# EAGLE schematic max10adc (EAGLE 8.6.1)
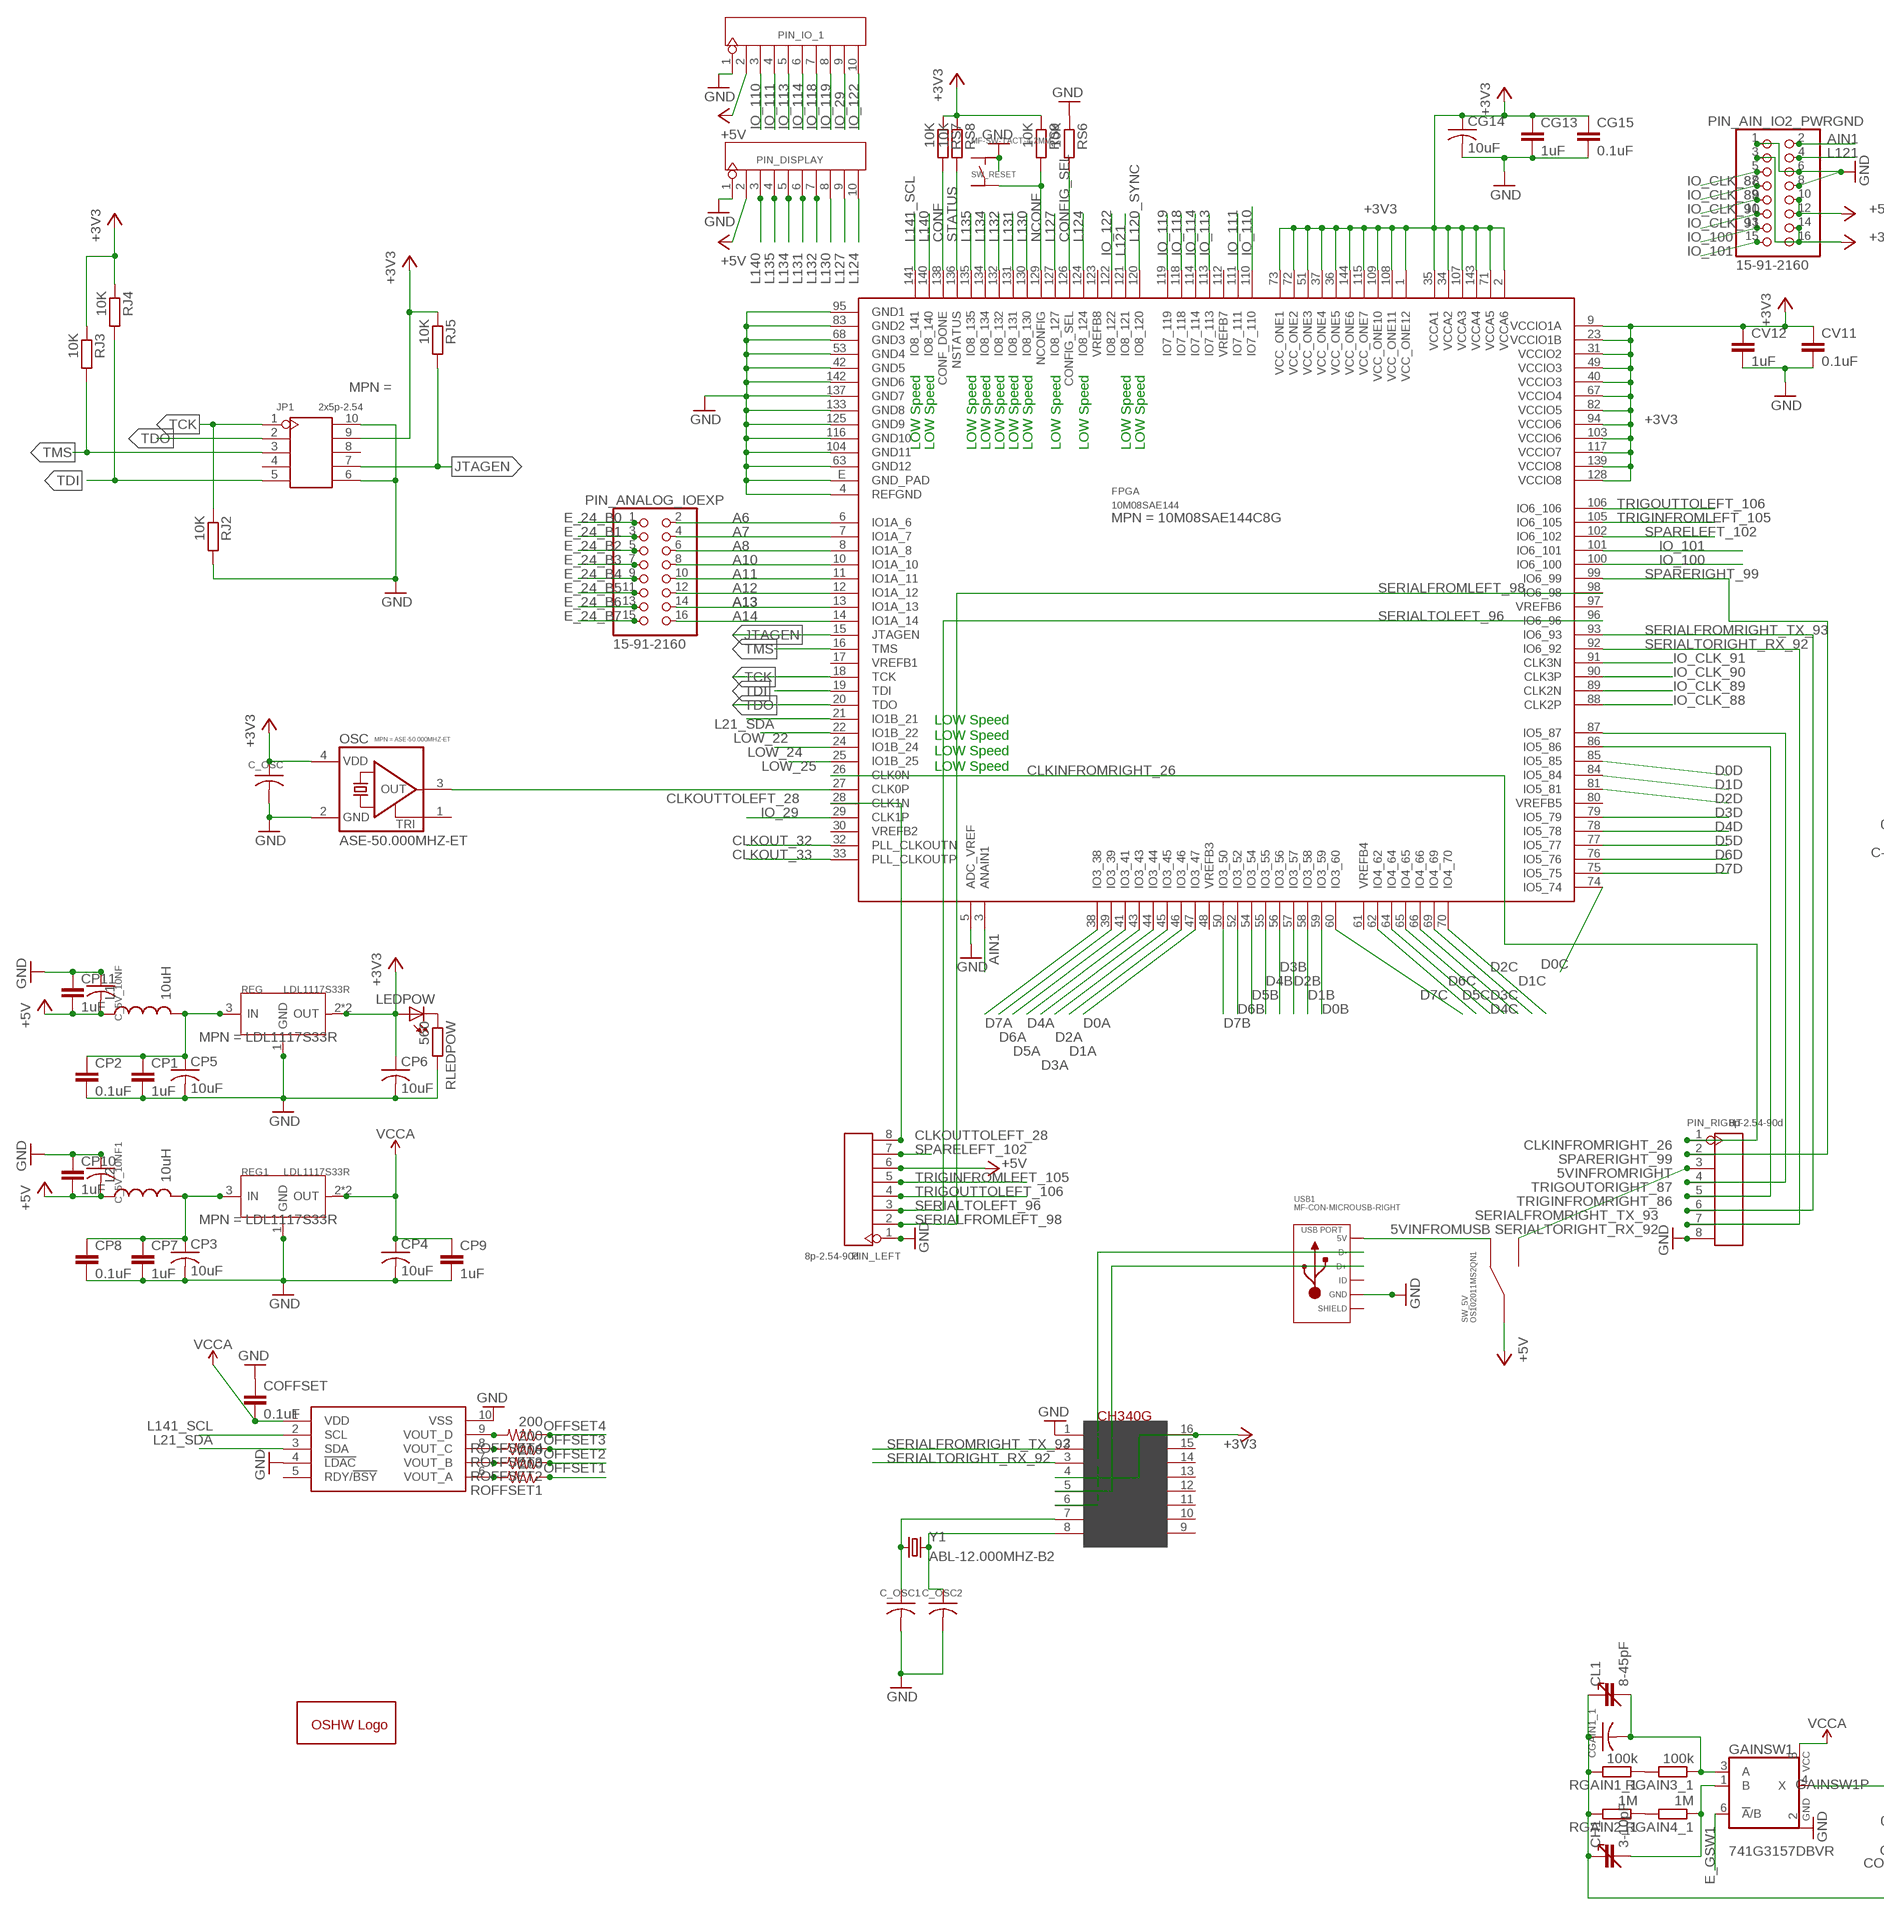
[diagram p0: schematic, sheet 1, part 1 of 2]
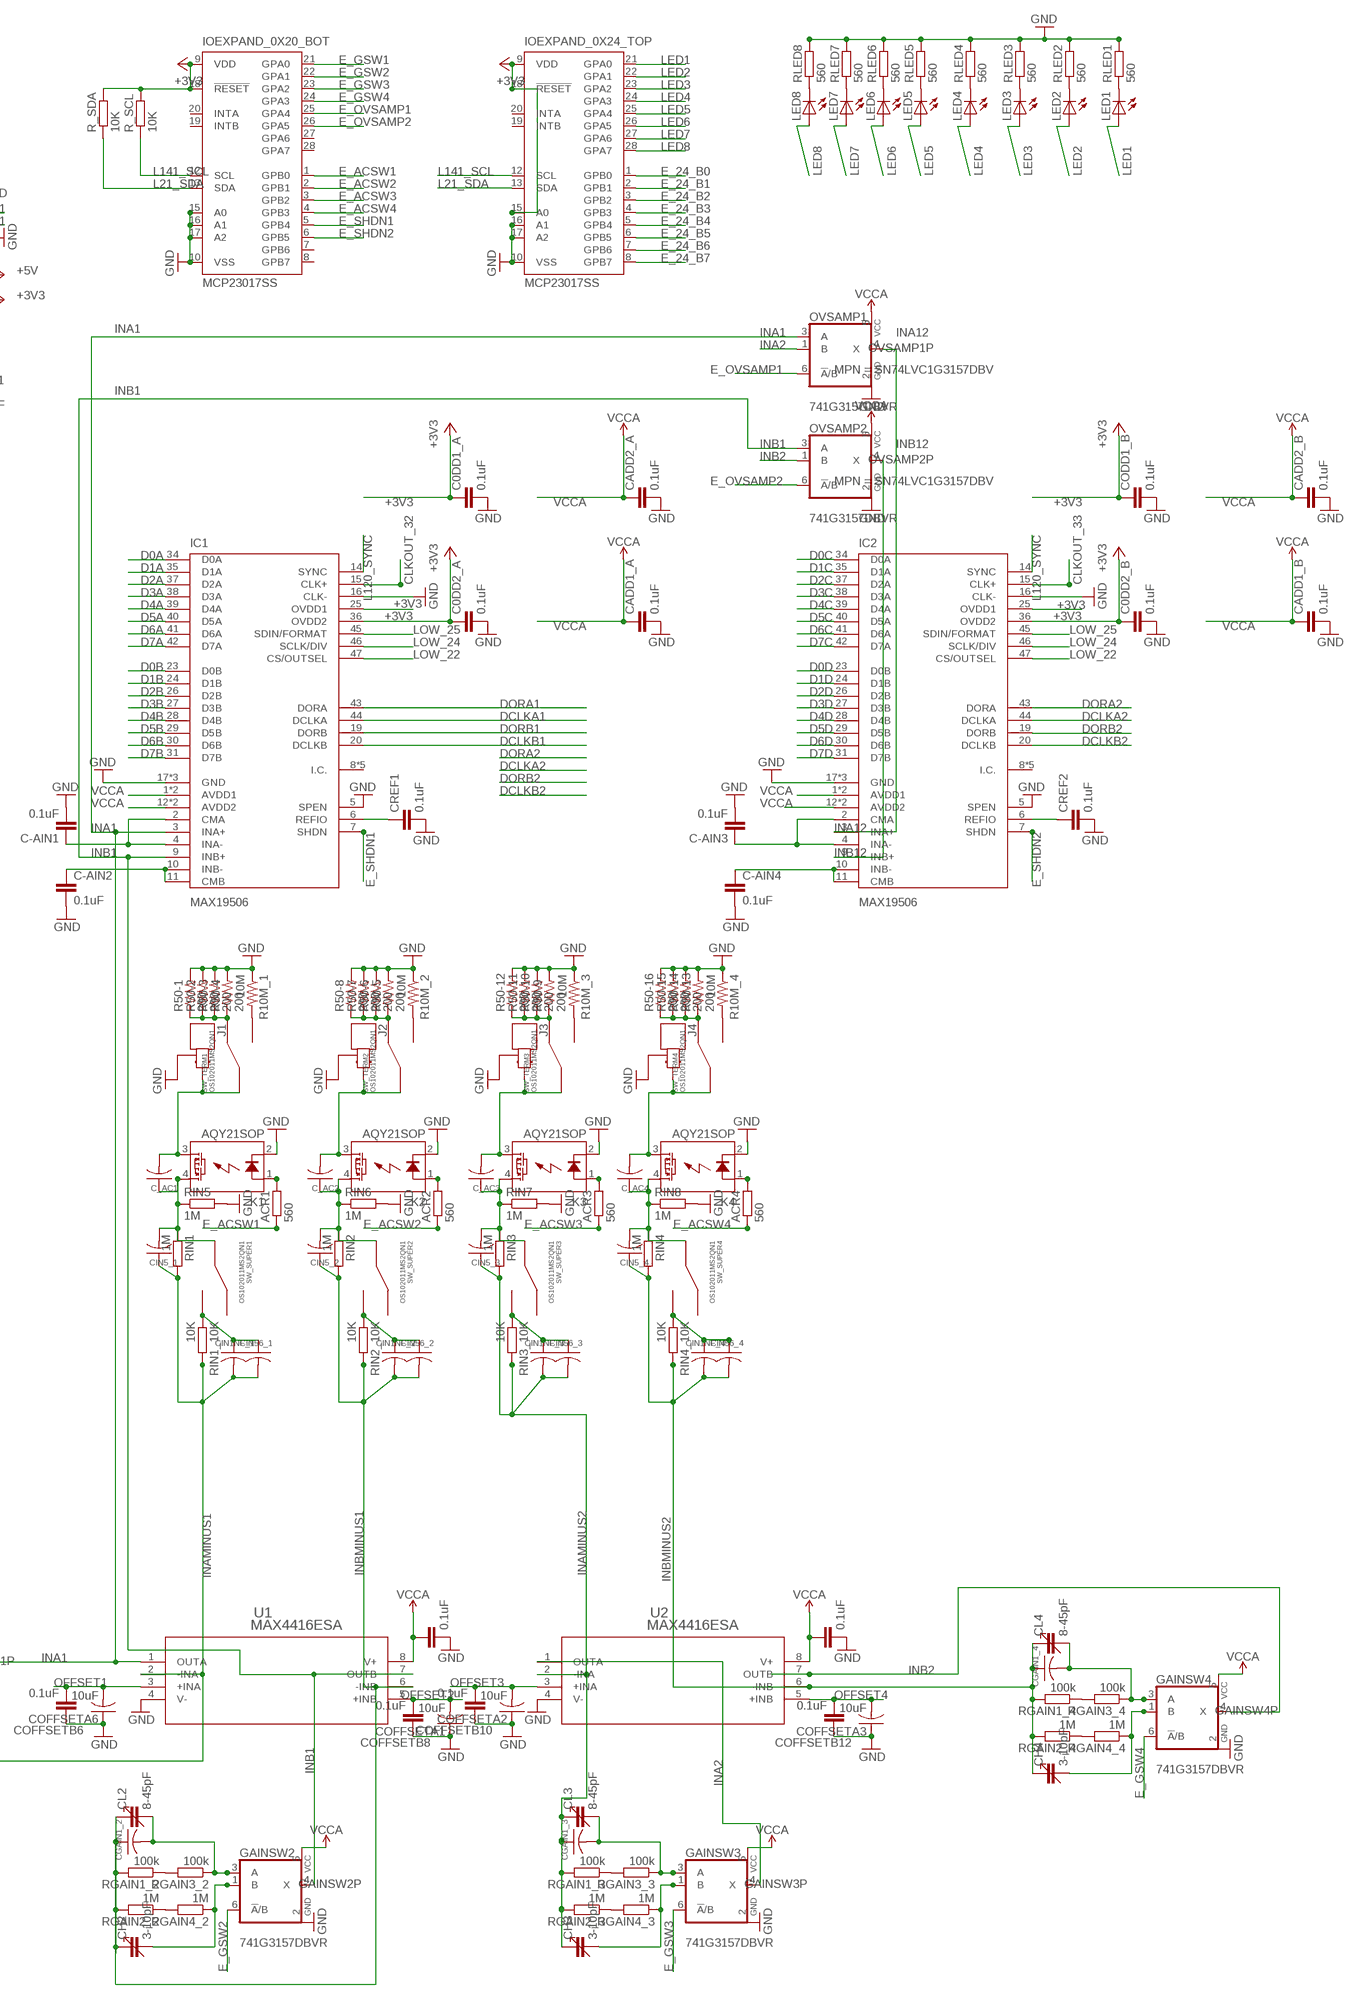
[diagram p1: schematic, sheet 1, part 2 of 2]

## Parts
ACR1  560  R-EU_R0805  [R0805]
ACR2  560  R-EU_R0805  [R0805]
ACR3  560  R-EU_R0805  [R0805]
ACR4  560  R-EU_R0805  [R0805]
C0DD1_A  0.1uF  C-EUC0805K  [C0805K]
C0DD2_A  0.1uF  C-EUC0805K  [C0805K]
C0DD2_B  0.1uF  C-EUC0805K  [C0805K]
C5VOPAMP1  0.1uF  C-EUC0805K  [C0805K]
C5VOPAMP2  0.1uF  C-EUC0805K  [C0805K]
C-AIN1  0.1uF  C-EUC0805K  [C0805K]
C-AIN2  0.1uF  C-EUC0805K  [C0805K]
C-AIN3  0.1uF  C-EUC0805K  [C0805K]
C-AIN4  0.1uF  C-EUC0805K  [C0805K]
C_5V_10NF  0.01uF  C-USC0603  [C0603]
C_5V_10NF1  0.01uF  C-USC0603  [C0603]
C_AC1  0.01uF  C-USC0603  [C0603]
C_AC2  0.01uF  C-USC0603  [C0603]
C_AC3  0.01uF  C-USC0603  [C0603]
C_AC4  0.01uF  C-USC0603  [C0603]
C_OSC  0.01uF  C-USC0603  [C0603]
C_OSC1  22pF  C-USC0603  [C0603]
C_OSC2  22pF  C-USC0603  [C0603]
CADD1_A  0.1uF  C-EUC0805K  [C0805K]
CADD1_B  0.1uF  C-EUC0805K  [C0805K]
CADD2_A  0.1uF  C-EUC0805K  [C0805K]
CADD2_B  0.1uF  C-EUC0805K  [C0805K]
CG13  1uF  C-EUC0805K  [C0805K]
CG14  10uF  C-USC1206  [C1206]
CG15  0.1uF  C-EUC0805K  [C0805K]
CGAIN1_1  33pF  C-USC0603  [C0603]
CGAIN1_2  33pF  C-USC0603  [C0603]
CGAIN1_3  33pF  C-USC0603  [C0603]
CGAIN1_4  33pF  C-USC0603  [C0603]
CH1  3-10pF  CAP_ADJSMD  [CTZ3]
CH2  3-10pF  CAP_ADJSMD  [CTZ3]
CH3  3-10pF  CAP_ADJSMD  [CTZ3]
CH4  3-10pF  CAP_ADJSMD  [CTZ3]
CIN1NF_1  1nF  C-USC0603  [C0603]
CIN1NF_2  1nF  C-USC0603  [C0603]
CIN1NF_3  1nF  C-USC0603  [C0603]
CIN1NF_4  1nF  C-USC0603  [C0603]
CIN5_1  10pF  C-USC0603  [C0603]
CIN5_2  10pF  C-USC0603  [C0603]
CIN5_3  10pF  C-USC0603  [C0603]
CIN5_4  10pF  C-USC0603  [C0603]
CIN56_1  56pF  C-USC0603  [C0603]
CIN56_2  56pF  C-USC0603  [C0603]
CIN56_3  56pF  C-USC0603  [C0603]
CIN56_4  56pF  C-USC0603  [C0603]
CL1  8-45pF  CAP_ADJSMD  [CTZ3]
CL2  8-45pF  CAP_ADJSMD  [CTZ3]
CL3  8-45pF  CAP_ADJSMD  [CTZ3]
CL4  8-45pF  CAP_ADJSMD  [CTZ3]
CODD1_B  0.1uF  C-EUC0805K  [C0805K]
COFFSET  0.1uF  C-EUC0805K  [C0805K]
COFFSETA1  10uF  C-USC1206  [C1206]
COFFSETA2  10uF  C-USC1206  [C1206]
COFFSETA3  10uF  C-USC1206  [C1206]
COFFSETA6  10uF  C-USC1206  [C1206]
COFFSETB6  0.1uF  C-EUC0805K  [C0805K]
COFFSETB8  0.1uF  C-EUC0805K  [C0805K]
COFFSETB10  0.1uF  C-EUC0805K  [C0805K]
COFFSETB12  0.1uF  C-EUC0805K  [C0805K]
CP1  1uF  C-EUC0805K  [C0805K]
CP2  0.1uF  C-EUC0805K  [C0805K]
CP3  10uF  C-USC1206  [C1206]
CP4  10uF  C-USC1206  [C1206]
CP5  10uF  C-USC1206  [C1206]
CP6  10uF  C-USC1206  [C1206]
CP7  1uF  C-EUC0805K  [C0805K]
CP8  0.1uF  C-EUC0805K  [C0805K]
CP9  1uF  C-EUC0805K  [C0805K]
CP10  1uF  C-EUC0805K  [C0805K]
CP11  1uF  C-EUC0805K  [C0805K]
CREF1  0.1uF  C-EUC0805K  [C0805K]
CREF2  0.1uF  C-EUC0805K  [C0805K]
CV11  0.1uF  C-EUC0805K  [C0805K]
CV12  1uF  C-EUC0805K  [C0805K]
DAC1  MCP4728  [MSOP10]
FPGA  10M08SAE144  [EQFP144]
GAINSW1  741G3157DBVR  [DBV_R-PDSO-G6]
GAINSW2  741G3157DBVR  [DBV_R-PDSO-G6]
GAINSW3  741G3157DBVR  [DBV_R-PDSO-G6]
GAINSW4  741G3157DBVR  [DBV_R-PDSO-G6]
GOLD_ORB_SM1  OSHWLOGOLOGO8MM  [OSHW_8MM]
IC1  MAX19506  [TQFP-48]
IC2  MAX19506  [TQFP-48]
IOEXPAND_0X20_BOT  MCP23017SS  [SSOP28]
IOEXPAND_0X24_TOP  MCP23017SS  [SSOP28]
J1  MOLEX_BNC_73100-0105  [MOLEX-BNC-73100-0105]
J2  MOLEX_BNC_73100-0105  [MOLEX-BNC-73100-0105]
J3  MOLEX_BNC_73100-0105  [MOLEX-BNC-73100-0105]
J4  MOLEX_BNC_73100-0105  [MOLEX-BNC-73100-0105]
JP1  2x5p-2.54  DIP-BLACK-MALE-HEADER(2X5P-2.54)  [H2X5-2.54]
K1  AQY21SOP  [SOP04]
K2  AQY21SOP  [SOP04]
K3  AQY21SOP  [SOP04]
K4  AQY21SOP  [SOP04]
L1  10uH  INDUCTOR1210  [1210]
L2  10uH  INDUCTOR1210  [1210]
LED1  MF-LED-0805-RED  LEDSML0805  [SML0805]
LED2  MF-LED-0805-RED  LEDSML0805  [SML0805]
LED3  MF-LED-0805-RED  LEDSML0805  [SML0805]
LED4  MF-LED-0805-RED  LEDSML0805  [SML0805]
LED5  MF-LED-0805-RED  LEDSML0805  [SML0805]
LED6  MF-LED-0805-RED  LEDSML0805  [SML0805]
LED7  MF-LED-0805-RED  LEDSML0805  [SML0805]
LED8  MF-LED-0805-RED  LEDSML0805  [SML0805]
LEDPOW  MF-LED-0805-RED  LEDSML0805  [SML0805]
OSC  ASE-50.000MHZ-ET  ASE  [ASE]
OVSAMP1  741G3157DBVR  [DBV_R-PDSO-G6]
OVSAMP2  741G3157DBVR  [DBV_R-PDSO-G6]
PIN_AIN_IO2_PWRGND  15-91-2160  PINHD-2X8SMT  [2X08_SMT]
PIN_ANALOG_IOEXP  15-91-2160  PINHD-2X8SMT  [2X08_SMT]
PIN_DISPLAY  YELLOW-10P-2.54  DIP-YELLOW-FEMALE-HEADER-VERT(10P-2.54)  [H10-2.54]
PIN_IO_1  YELLOW-10P-2.54  DIP-YELLOW-FEMALE-HEADER-VERT(10P-2.54)  [H10-2.54]
PIN_LEFT  8p-2.54-90d  DIP-BLACK-SHORT-MALE-HEADER-R/A(8P-2.54-90D)  [H8-2.54-90D-MALE]
PIN_RIGHT  8p-2.54-90d  DIP-BLACK-FEMALE-HEADER-R/A(8P-2.54-90D)  [H8-2.54-90D-FEMALE]
R10M_1  10M  R-US_R0805  [R0805]
R10M_2  10M  R-US_R0805  [R0805]
R10M_3  10M  R-US_R0805  [R0805]
R10M_4  10M  R-US_R0805  [R0805]
R50-1  200  R-US_R0805  [R0805]
R50-2  200  R-US_R0805  [R0805]
R50-3  200  R-US_R0805  [R0805]
R50-4  200  R-US_R0805  [R0805]
R50-5  200  R-US_R0805  [R0805]
R50-6  200  R-US_R0805  [R0805]
R50-7  200  R-US_R0805  [R0805]
R50-8  200  R-US_R0805  [R0805]
R50-9  200  R-US_R0805  [R0805]
R50-10  200  R-US_R0805  [R0805]
R50-11  200  R-US_R0805  [R0805]
R50-12  200  R-US_R0805  [R0805]
R50-13  200  R-US_R0805  [R0805]
R50-14  200  R-US_R0805  [R0805]
R50-15  200  R-US_R0805  [R0805]
R50-16  200  R-US_R0805  [R0805]
R_SCL  10K  R-EU_R0805  [R0805]
R_SDA  10K  R-EU_R0805  [R0805]
REG  LDL1117S33R  PMIC-CJT1117-3.3(SOT223)  [SOT-223]
REG1  LDL1117S33R  PMIC-CJT1117-3.3(SOT223)  [SOT-223]
RGAIN1_1  100k  R-EU_R0805  [R0805]
RGAIN1_2  100k  R-EU_R0805  [R0805]
RGAIN1_3  100k  R-EU_R0805  [R0805]
RGAIN1_4  100k  R-EU_R0805  [R0805]
RGAIN2_1  1M  R-EU_R0805  [R0805]
RGAIN2_2  1M  R-EU_R0805  [R0805]
RGAIN2_3  1M  R-EU_R0805  [R0805]
RGAIN2_4  1M  R-EU_R0805  [R0805]
RGAIN3_1  100k  R-EU_R0805  [R0805]
RGAIN3_2  100k  R-EU_R0805  [R0805]
RGAIN3_3  100k  R-EU_R0805  [R0805]
RGAIN3_4  100k  R-EU_R0805  [R0805]
RGAIN4_1  1M  R-EU_R0805  [R0805]
RGAIN4_2  1M  R-EU_R0805  [R0805]
RGAIN4_3  1M  R-EU_R0805  [R0805]
RGAIN4_4  1M  R-EU_R0805  [R0805]
RIN1  1M  R-EU_R0805  [R0805]
RIN1_10K  10K  R-EU_R0805  [R0805]
RIN2  1M  R-EU_R0805  [R0805]
RIN2_10K  10K  R-EU_R0805  [R0805]
RIN3  1M  R-EU_R0805  [R0805]
RIN3_10K  10K  R-EU_R0805  [R0805]
RIN4  1M  R-EU_R0805  [R0805]
RIN4_10K  10K  R-EU_R0805  [R0805]
RIN5  1M  R-EU_R0805  [R0805]
RIN6  1M  R-EU_R0805  [R0805]
RIN7  1M  R-EU_R0805  [R0805]
RIN8  1M  R-EU_R0805  [R0805]
RJ2  10K  R-EU_R0805  [R0805]
RJ3  10K  R-EU_R0805  [R0805]
RJ4  10K  R-EU_R0805  [R0805]
RJ5  10K  R-EU_R0805  [R0805]
RLED1  560  R-EU_R0805  [R0805]
RLED2  560  R-EU_R0805  [R0805]
RLED3  560  R-EU_R0805  [R0805]
RLED4  560  R-EU_R0805  [R0805]
RLED5  560  R-EU_R0805  [R0805]
RLED6  560  R-EU_R0805  [R0805]
RLED7  560  R-EU_R0805  [R0805]
RLED8  560  R-EU_R0805  [R0805]
RLEDPOW  560  R-EU_R0805  [R0805]
ROFFSET1  200  R-US_R0805  [R0805]
ROFFSET2  200  R-US_R0805  [R0805]
ROFFSET3  200  R-US_R0805  [R0805]
ROFFSET4  200  R-US_R0805  [R0805]
RS6  10K  R-EU_R0805  [R0805]
RS7  10K  R-EU_R0805  [R0805]
RS8  10K  R-EU_R0805  [R0805]
RS9  10K  R-EU_R0805  [R0805]
SW_5V  OS102011MS2QN1  SPDT_0S102011MS2QS1  [0S102011MS2QS1]
SW_RESET  MF-SW-TACT-4.2MM  TACT_4.2MM  [TACT4.2MM]
SW_SUPER1  OS102011MS2QN1  SPDT_0S102011MS2QS1  [0S102011MS2QS1]
SW_SUPER2  OS102011MS2QN1  SPDT_0S102011MS2QS1  [0S102011MS2QS1]
SW_SUPER3  OS102011MS2QN1  SPDT_0S102011MS2QS1  [0S102011MS2QS1]
SW_SUPER4  OS102011MS2QN1  SPDT_0S102011MS2QS1  [0S102011MS2QS1]
SW_TERM1  OS102011MS2QN1  SPDT_0S102011MS2QS1  [0S102011MS2QS1]
SW_TERM2  OS102011MS2QN1  SPDT_0S102011MS2QS1  [0S102011MS2QS1]
SW_TERM3  OS102011MS2QN1  SPDT_0S102011MS2QS1  [0S102011MS2QS1]
SW_TERM4  OS102011MS2QN1  SPDT_0S102011MS2QS1  [0S102011MS2QS1]
U1  MAX4416ESA  LMH6724MAX  [M08A]
U2  MAX4416ESA  LMH6724MAX  [M08A]
U340G  CH340G  [SOIC16]
USB1  MF-CON-MICROUSB-RIGHT  USB_5PIN_10118193-0001LF  [10118193-0001LF]
Y1  ABL-12.000MHZ-B2  CRYSTALHC49US  [HC49US]

## Nets
5VINFROMRIGHT [five]: PIN_RIGHT.3 SW_5V.3
5VINFROMUSB [five]: SW_5V.1 USB1.1(5V)
+3V3 [three]: C0DD1_A.1 C0DD2_A.1 C0DD2_B.1 C_OSC.1 CG13.1 CG14.1 CG15.1 CODD1_B.1 CP6.1 CV11.1 CV12.1 FPGA.1(VCC_ONE12) FPGA.2(VCCA6) FPGA.9(VCCIO1A) FPGA.23(VCCIO1B) FPGA.31(VCCIO2) FPGA.34(VCCA2) FPGA.35(VCCA1) FPGA.36(VCC_ONE5) FPGA.37(VCC_ONE4) FPGA.40(VCCIO3) FPGA.49(VCCIO3) FPGA.51(VCC_ONE3) FPGA.67(VCCIO4) FPGA.71(VCCA5) FPGA.72(VCC_ONE2) FPGA.73(VCC_ONE1) FPGA.82(VCCIO5) FPGA.94(VCCIO6) FPGA.103(VCCIO6) FPGA.107(VCCA3) FPGA.108(VCC_ONE11) FPGA.109(VCC_ONE10) FPGA.115(VCC_ONE7) FPGA.117(VCCIO7) FPGA.128(VCCIO8) FPGA.139(VCCIO8) FPGA.143(VCCA4) FPGA.144(VCC_ONE6) IC1.25(OVDD1) IC1.36(OVDD2) IC2.25(OVDD1) IC2.36(OVDD2) IOEXPAND_0X20_BOT.9(VDD) IOEXPAND_0X20_BOT.18(!RESET) IOEXPAND_0X24_TOP.9(VDD) IOEXPAND_0X24_TOP.15(A0) IOEXPAND_0X24_TOP.18(!RESET) JP1.9 LEDPOW.A OSC.4(VDD) PIN_AIN_IO2_PWRGND.3 PIN_AIN_IO2_PWRGND.14 PIN_AIN_IO2_PWRGND.16 R_SCL.2 R_SDA.2 REG.2(OUT) REG.TER(OUT) RJ3.1 RJ4.1 RJ5.1 RS7.1 RS8.1 RS9.1 U340G.4(V3) U340G.16(VCC)
+5V [five]: C_5V_10NF1.2 C_5V_10NF.2 CP10.2 CP11.2 L1.1 L2.1 PIN_AIN_IO2_PWRGND.10 PIN_AIN_IO2_PWRGND.12 PIN_DISPLAY.2 PIN_IO_1.2 PIN_LEFT.6 SW_5V.2(C)
A6: FPGA.6(IO1A_6) PIN_ANALOG_IOEXP.2
A7: FPGA.7(IO1A_7) PIN_ANALOG_IOEXP.4
A8: FPGA.8(IO1A_8) PIN_ANALOG_IOEXP.6
A10: FPGA.10(IO1A_10) PIN_ANALOG_IOEXP.8
A11: FPGA.11(IO1A_11) PIN_ANALOG_IOEXP.10
A12: FPGA.12(IO1A_12) PIN_ANALOG_IOEXP.12
A13: FPGA.13(IO1A_13) PIN_ANALOG_IOEXP.14
A14: FPGA.14(IO1A_14) PIN_ANALOG_IOEXP.16
AIN1: FPGA.3(ANAIN1) PIN_AIN_IO2_PWRGND.2
CGAIN1: CGAIN1_1.2 CL1.- GAINSW1.3(A) RGAIN3_1.1
CGAIN2: CH1.- GAINSW1.1(B) RGAIN4_1.1
CGAIN3: CGAIN1_2.2 CL2.- GAINSW2.3(A) RGAIN3_2.1
CGAIN4: CH2.- GAINSW2.1(B) RGAIN4_2.1
CGAIN5: CGAIN1_3.2 CL3.- GAINSW3.3(A) RGAIN3_3.1
CGAIN6: CH3.- GAINSW3.1(B) RGAIN4_3.1
CGAIN7: CGAIN1_4.2 CL4.- GAINSW4.3(A) RGAIN3_4.1
CGAIN8: CH4.- GAINSW4.1(B) RGAIN4_4.1
CLKINFROMRIGHT_26: FPGA.26(CLK0N) PIN_RIGHT.1
CLKOUT_32: FPGA.32(PLL_CLKOUTN) IC1.15(CLK+)
CLKOUT_33: FPGA.33(PLL_CLKOUTP) IC2.15(CLK+)
CLKOUTTOLEFT_28: FPGA.28(CLK1N) PIN_LEFT.8
CONF: FPGA.138(CONF_DONE) RS7.2
CONFIG_SEL: FPGA.126(CONFIG_SEL) RS6.2
D0A: FPGA.47(IO3_47) IC1.34(D0A)
D0B: FPGA.59(IO3_59) IC1.23(D0B)
D0C: FPGA.74(IO5_74) IC2.34(D0A)
D0D: FPGA.85(IO5_85) IC2.23(D0B)
D1A: FPGA.46(IO3_46) IC1.35(D1A)
D1B: FPGA.58(IO3_58) IC1.24(D1B)
D1C: FPGA.70(IO4_70) IC2.35(D1A)
D1D: FPGA.84(IO5_84) IC2.24(D1B)
D2A: FPGA.45(IO3_45) IC1.37(D2A)
D2B: FPGA.57(IO3_57) IC1.26(D2B)
D2C: FPGA.69(IO4_69) IC2.37(D2A)
D2D: FPGA.81(IO5_81) IC2.26(D2B)
D3A: FPGA.44(IO3_44) IC1.38(D3A)
D3B: FPGA.56(IO3_56) IC1.27(D3B)
D3C: FPGA.66(IO4_66) IC2.38(D3A)
D3D: FPGA.79(IO5_79) IC2.27(D3B)
D4A: FPGA.43(IO3_43) IC1.39(D4A)
D4B: FPGA.55(IO3_55) IC1.28(D4B)
D4C: FPGA.65(IO4_65) IC2.39(D4A)
D4D: FPGA.78(IO5_78) IC2.28(D4B)
D5A: FPGA.41(IO3_41) IC1.40(D5A)
D5B: FPGA.54(IO3_54) IC1.29(D5B)
D5C: FPGA.64(IO4_64) IC2.40(D5A)
D5D: FPGA.77(IO5_77) IC2.29(D5B)
D6A: FPGA.39(IO3_39) IC1.41(D6A)
D6B: FPGA.52(IO3_52) IC1.30(D6B)
D6C: FPGA.62(IO4_62) IC2.41(D6A)
D6D: FPGA.76(IO5_76) IC2.30(D6B)
D7A: FPGA.38(IO3_38) IC1.42(D7A)
D7B: FPGA.50(IO3_50) IC1.31(D7B)
D7C: FPGA.60(IO3_60) IC2.42(D7A)
D7D: FPGA.75(IO5_75) IC2.31(D7B)
DCLKA1: IC1.44(DCLKA)
DCLKA2: IC2.44(DCLKA)
DCLKB1: IC1.20(DCLKB)
DCLKB2: IC2.20(DCLKB)
DMINUS: U340G.6(D-) USB1.2(D-)
DORA1: IC1.43(DORA)
DORA2: IC2.43(DORA)
DORB1: IC1.19(DORB)
DORB2: IC2.19(DORB)
DPLUS: U340G.5(D+) USB1.3(D+)
E_24_B0: IOEXPAND_0X24_TOP.1(GPB0) PIN_ANALOG_IOEXP.1
E_24_B1: IOEXPAND_0X24_TOP.2(GPB1) PIN_ANALOG_IOEXP.3
E_24_B2: IOEXPAND_0X24_TOP.3(GPB2) PIN_ANALOG_IOEXP.5
E_24_B3: IOEXPAND_0X24_TOP.4(GPB3) PIN_ANALOG_IOEXP.7
E_24_B4: IOEXPAND_0X24_TOP.5(GPB4) PIN_ANALOG_IOEXP.9
E_24_B5: IOEXPAND_0X24_TOP.6(GPB5) PIN_ANALOG_IOEXP.11
E_24_B6: IOEXPAND_0X24_TOP.7(GPB6) PIN_ANALOG_IOEXP.13
E_24_B7: IOEXPAND_0X24_TOP.8(GPB7) PIN_ANALOG_IOEXP.15
E_ACSW1: ACR1.1 IOEXPAND_0X20_BOT.1(GPB0)
E_ACSW2: ACR2.1 IOEXPAND_0X20_BOT.2(GPB1)
E_ACSW3: ACR3.1 IOEXPAND_0X20_BOT.3(GPB2)
E_ACSW4: ACR4.1 IOEXPAND_0X20_BOT.4(GPB3)
E_GSW1: GAINSW1.6(!A!/B) IOEXPAND_0X20_BOT.21(GPA0)
E_GSW2: GAINSW2.6(!A!/B) IOEXPAND_0X20_BOT.22(GPA1)
E_GSW3: GAINSW3.6(!A!/B) IOEXPAND_0X20_BOT.23(GPA2)
E_GSW4: GAINSW4.6(!A!/B) IOEXPAND_0X20_BOT.24(GPA3)
E_OVSAMP1: IOEXPAND_0X20_BOT.25(GPA4) OVSAMP1.6(!A!/B)
E_OVSAMP2: IOEXPAND_0X20_BOT.26(GPA5) OVSAMP2.6(!A!/B)
E_SHDN1: IC1.7(SHDN) IOEXPAND_0X20_BOT.5(GPB4)
E_SHDN2: IC2.7(SHDN) IOEXPAND_0X20_BOT.6(GPB5)
GND [gnd]: C0DD1_A.2 C0DD2_A.2 C0DD2_B.2 C5VOPAMP1.2 C5VOPAMP2.2 C-AIN1.2 C-AIN2.2 C-AIN3.2 C-AIN4.2 C_5V_10NF1.1 C_5V_10NF.1 C_OSC1.2 C_OSC2.2 C_OSC.2 CADD1_A.2 CADD1_B.2 CADD2_A.2 CADD2_B.2 CG13.2 CG14.2 CG15.2 CODD1_B.2 COFFSET.1 COFFSETA1.1 COFFSETA2.1 COFFSETA3.1 COFFSETA6.1 COFFSETB6.1 COFFSETB8.1 COFFSETB10.1 COFFSETB12.1 CP1.2 CP2.2 CP3.2 CP4.2 CP5.2 CP6.2 CP7.2 CP8.2 CP9.2 CP10.1 CP11.1 CREF1.2 CREF2.2 CV11.2 CV12.2 DAC1.4(!LDAC) DAC1.10(VSS) FPGA.4(REFGND) FPGA.5(ADC_VREF) FPGA.42(GND5) FPGA.53(GND4) FPGA.63(GND12) FPGA.68(GND3) FPGA.83(GND2) FPGA.95(GND1) FPGA.104(GND11) FPGA.116(GND10) FPGA.125(GND9) FPGA.133(GND8) FPGA.137(GND7) FPGA.142(GND6) FPGA.E(GND_PAD) GAINSW1.2(GND) GAINSW2.2(GND) GAINSW3.2(GND) GAINSW4.2(GND) IC1.5(SPEN) IC1.16(CLK-) IC1.17(GND) IC1.18(GND) IC1.EP_GND(GND) IC2.5(SPEN) IC2.16(CLK-) IC2.17(GND) IC2.18(GND) IC2.EP_GND(GND) IOEXPAND_0X20_BOT.10(VSS) IOEXPAND_0X20_BOT.15(A0) IOEXPAND_0X20_BOT.16(A1) IOEXPAND_0X20_BOT.17(A2) IOEXPAND_0X24_TOP.10(VSS) IOEXPAND_0X24_TOP.16(A1) IOEXPAND_0X24_TOP.17(A2) J1.GND1(GND) J1.GND2(GND) J2.GND1(GND) J2.GND2(GND) J3.GND1(GND) J3.GND2(GND) J4.GND1(GND) J4.GND2(GND) JP1.6 JP1.10 K1.2(K) K2.2(K) K3.2(K) K4.2(K) OSC.2(GND) OVSAMP1.2(GND) OVSAMP2.2(GND) PIN_AIN_IO2_PWRGND.1 PIN_AIN_IO2_PWRGND.6 PIN_AIN_IO2_PWRGND.8 PIN_DISPLAY.1 PIN_IO_1.1 PIN_LEFT.1 PIN_RIGHT.8 R10M_1.1 R10M_2.1 R10M_3.1 R10M_4.1 R50-1.2 R50-2.2 R50-3.2 R50-4.2 R50-5.2 R50-6.2 R50-7.2 R50-8.2 R50-9.2 R50-10.2 R50-11.2 R50-12.2 R50-13.2 R50-14.2 R50-15.2 R50-16.2 REG1.1(GND) REG.1(GND) RIN5.2 RIN6.2 RIN7.2 RIN8.2 RJ2.2 RLED1.2 RLED2.2 RLED3.2 RLED4.2 RLED5.2 RLED6.2 RLED7.2 RLED8.2 RLEDPOW.2 RS6.1 SW_RESET.P$2 U1.4(V-) U2.4(V-) U340G.1(GND) USB1.5(GND)
INA1: GAINSW1.4(X) IC1.3(INA+) OVSAMP1.3(A) U1.1(OUTA)
INA2: GAINSW3.4(X) OVSAMP1.1(B) U2.1(OUTA)
INA12: IC2.3(INA+) OVSAMP1.4(X)
INA-1: C-AIN1.1 IC1.2(CMA) IC1.4(INA-)
INA-2: C-AIN3.1 IC2.2(CMA) IC2.4(INA-)
INAMINUS1: CGAIN1_1.1 CH1.+ CIN1NF_1.2 CIN5_1.1 CIN56_1.2 CL1.+ RGAIN1_1.2 RGAIN2_1.2 RIN1.2 RIN1_10K.2 U1.2(-INA)
INAMINUS2: CGAIN1_3.1 CH3.+ CIN1NF_3.2 CIN5_3.1 CIN56_3.2 CL3.+ RGAIN1_3.2 RGAIN2_3.2 RIN3.2 RIN3_10K.2 U2.2(-INA)
INB1: GAINSW2.4(X) IC1.9(INB+) OVSAMP2.3(A) U1.7(OUTB)
INB2: GAINSW4.4(X) OVSAMP2.1(B) U2.7(OUTB)
INB12: IC2.9(INB+) OVSAMP2.4(X)
INB-1: C-AIN2.1 IC1.10(INB-) IC1.11(CMB)
INB-2: C-AIN4.1 IC2.10(INB-) IC2.11(CMB)
INBMINUS1: CGAIN1_2.1 CH2.+ CIN1NF_2.2 CIN5_2.1 CIN56_2.2 CL2.+ RGAIN1_2.2 RGAIN2_2.2 RIN2.2 RIN2_10K.2 U1.6(-INB)
INBMINUS2: CGAIN1_4.1 CH4.+ CIN1NF_4.2 CIN5_4.1 CIN56_4.2 CL4.+ RGAIN1_4.2 RGAIN2_4.2 RIN4.2 RIN4_10K.2 U2.6(-INB)
INJ1: C_AC1.2 J1.SIGNAL K1.3(DS2) SW_TERM1.2(C)
INJ2: C_AC2.2 J2.SIGNAL K2.3(DS2) SW_TERM2.2(C)
INJ3: C_AC3.2 J3.SIGNAL K3.3(DS2) SW_TERM3.2(C)
INJ4: C_AC4.2 J4.SIGNAL K4.3(DS2) SW_TERM4.2(C)
IO_29: FPGA.29(CLK1P) PIN_IO_1.9
IO_100: FPGA.100(IO6_100) PIN_AIN_IO2_PWRGND.13
IO_101: FPGA.101(IO6_101) PIN_AIN_IO2_PWRGND.15
IO_110: FPGA.110(IO7_110) PIN_IO_1.3
IO_111: FPGA.111(IO7_111) PIN_IO_1.4
IO_113: FPGA.113(IO7_113) PIN_IO_1.5
IO_114: FPGA.114(IO7_114) PIN_IO_1.6
IO_118: FPGA.118(IO7_118) PIN_IO_1.7
IO_119: FPGA.119(IO7_119) PIN_IO_1.8
IO_122: FPGA.122(IO8_122) PIN_IO_1.10
IO_CLK_88: FPGA.88(CLK2P) PIN_AIN_IO2_PWRGND.5
IO_CLK_89: FPGA.89(CLK2N) PIN_AIN_IO2_PWRGND.7
IO_CLK_90: FPGA.90(CLK3P) PIN_AIN_IO2_PWRGND.9
IO_CLK_91: FPGA.91(CLK3N) PIN_AIN_IO2_PWRGND.11
JTAGEN: FPGA.15(JTAGEN) JP1.7 RJ5.2
L21_SDA: DAC1.3(SDA) FPGA.21(IO1B_21) IOEXPAND_0X20_BOT.13(SDA) IOEXPAND_0X24_TOP.13(SDA) R_SDA.1
L120_SYNC: FPGA.120(IO8_120) IC1.14(SYNC) IC2.14(SYNC)
L121: FPGA.121(IO8_121) PIN_AIN_IO2_PWRGND.4
L124: FPGA.124(IO8_124) PIN_DISPLAY.10
L127: FPGA.127(IO8_127) PIN_DISPLAY.9
L130: FPGA.130(IO8_130) PIN_DISPLAY.8
L131: FPGA.131(IO8_131) PIN_DISPLAY.6
L132: FPGA.132(IO8_132) PIN_DISPLAY.7
L134: FPGA.134(IO8_134) PIN_DISPLAY.5
L135: FPGA.135(IO8_135) PIN_DISPLAY.4
L140: FPGA.140(IO8_140) PIN_DISPLAY.3
L141_SCL: DAC1.2(SCL) FPGA.141(IO8_141) IOEXPAND_0X20_BOT.12(SCL) IOEXPAND_0X24_TOP.12(SCL) R_SCL.1
LED1: IOEXPAND_0X24_TOP.21(GPA0) LED1.A
LED2: IOEXPAND_0X24_TOP.22(GPA1) LED2.A
LED3: IOEXPAND_0X24_TOP.23(GPA2) LED3.A
LED4: IOEXPAND_0X24_TOP.24(GPA3) LED4.A
LED5: IOEXPAND_0X24_TOP.25(GPA4) LED5.A
LED6: IOEXPAND_0X24_TOP.26(GPA5) LED6.A
LED7: IOEXPAND_0X24_TOP.27(GPA6) LED7.A
LED8: IOEXPAND_0X24_TOP.28(GPA7) LED8.A
LOW_22: FPGA.22(IO1B_22) IC1.47(CS/OUTSEL) IC2.47(CS/OUTSEL)
LOW_24: FPGA.24(IO1B_24) IC1.46(SCLK/DIV) IC2.46(SCLK/DIV)
LOW_25: FPGA.25(IO1B_25) IC1.45(SDIN/FORMAT) IC2.45(SDIN/FORMAT)
N$1: LED4.C RLED4.1
N$2: RGAIN1_1.1 RGAIN3_1.2
N$3: RGAIN2_1.1 RGAIN4_1.2
N$4: RGAIN1_2.1 RGAIN3_2.2
N$5: RGAIN2_2.1 RGAIN4_2.2
N$6: RGAIN1_3.1 RGAIN3_3.2
N$7: RGAIN2_3.1 RGAIN4_3.2
N$8: RGAIN1_4.1 RGAIN3_4.2
N$9: RGAIN2_4.1 RGAIN4_4.2
N$10: C_AC1.1 CIN5_1.2 K1.4(DS1) RIN1.1 RIN5.1 SW_SUPER1.2(C)
N$11: ACR1.2 K1.1(A)
N$12: LED3.C RLED3.1
N$13: LED2.C RLED2.1
N$14: LED1.C RLED1.1
N$15: C_AC2.1 CIN5_2.2 K2.4(DS1) RIN2.1 RIN6.1 SW_SUPER2.2(C)
N$16: LED6.C RLED6.1
N$17: LED5.C RLED5.1
N$19: LED7.C RLED7.1
N$20: CIN1NF_1.1 CIN56_1.1 RIN1_10K.1 SW_SUPER1.3
N$21: ACR2.2 K2.1(A)
N$22: LED8.C RLED8.1
N$23: C_OSC1.1 U340G.7(XI) Y1.1
N$24: R10M_1.2 SW_TERM1.3
N$25: R50-5.1 R50-6.1 R50-7.1 R50-8.1 SW_TERM2.1
N$26: R50-9.1 R50-10.1 R50-11.1 R50-12.1 SW_TERM3.1
N$27: R10M_2.2 SW_TERM2.3
N$28: R50-13.1 R50-14.1 R50-15.1 R50-16.1 SW_TERM4.1
N$29: R50-1.1 R50-2.1 R50-3.1 R50-4.1 SW_TERM1.1
N$30: R10M_3.2 SW_TERM3.3
N$31: C_OSC2.1 U340G.8(XO) Y1.2
N$32: ACR3.2 K3.1(A)
N$33: R10M_4.2 SW_TERM4.3
N$34: LEDPOW.C RLEDPOW.1
N$35: ACR4.2 K4.1(A)
N$36: CIN1NF_4.1 CIN56_4.1 RIN4_10K.1 SW_SUPER4.3
N$38: CIN1NF_2.1 CIN56_2.1 RIN2_10K.1 SW_SUPER2.3
N$39: C_AC3.1 CIN5_3.2 K3.4(DS1) RIN3.1 RIN7.1 SW_SUPER3.2(C)
N$40: CIN1NF_3.1 CIN56_3.1 RIN3_10K.1 SW_SUPER3.3
N$41: C_AC4.1 CIN5_4.2 K4.4(DS1) RIN4.1 RIN8.1 SW_SUPER4.2(C)
N$44: DAC1.6(VOUT_A) ROFFSET1.2
N$45: DAC1.7(VOUT_B) ROFFSET2.2
N$46: DAC1.8(VOUT_C) ROFFSET3.2
N$47: DAC1.9(VOUT_D) ROFFSET4.2
N$48 [five]: CP3.1 CP7.1 CP8.1 L2.2 REG1.3(IN)
N$49 [five]: CP1.1 CP2.1 CP5.1 L1.2 REG.3(IN)
NCONF: FPGA.129(NCONFIG) RS9.2 SW_RESET.P$4
OFFSET1: COFFSETA6.2 COFFSETB6.2 ROFFSET1.1 U1.3(+INA)
OFFSET2: COFFSETA1.2 COFFSETB8.2 ROFFSET2.1 U1.5(+INB)
OFFSET3: COFFSETA2.2 COFFSETB10.2 ROFFSET3.1 U2.3(+INA)
OFFSET4: COFFSETA3.2 COFFSETB12.2 ROFFSET4.1 U2.5(+INB)
OSC1: FPGA.27(CLK0P) OSC.3(OUT)
REF1: CREF1.1 IC1.6(REFIO)
REF2: CREF2.1 IC2.6(REFIO)
SERIALFROMLEFT_98: FPGA.98(IO6_98) PIN_LEFT.2
SERIALFROMRIGHT_TX_93: FPGA.93(IO6_93) PIN_RIGHT.6 U340G.2(TX)
SERIALTOLEFT_96: FPGA.96(IO6_96) PIN_LEFT.3
SERIALTORIGHT_RX_92: FPGA.92(IO6_92) PIN_RIGHT.7 U340G.3(RX)
SPARELEFT_102: FPGA.102(IO6_102) PIN_LEFT.7
SPARERIGHT_99: FPGA.99(IO6_99) PIN_RIGHT.2
STATUS: FPGA.136(NSTATUS) RS8.2
TCK: FPGA.18(TCK) JP1.1 RJ2.1
TDI: FPGA.19(TDI) JP1.5 RJ4.2
TDO: FPGA.20(TDO) JP1.2
TMS: FPGA.16(TMS) JP1.3 RJ3.2
TRIGINFROMLEFT_105: FPGA.105(IO6_105) PIN_LEFT.5
TRIGINFROMRIGHT_86: FPGA.86(IO5_86) PIN_RIGHT.5
TRIGOUTORIGHT_87: FPGA.87(IO5_87) PIN_RIGHT.4
TRIGOUTTOLEFT_106: FPGA.106(IO6_106) PIN_LEFT.4
VCCA [three]: C5VOPAMP1.1 C5VOPAMP2.1 CADD1_A.1 CADD1_B.1 CADD2_A.1 CADD2_B.1 COFFSET.2 CP4.1 CP9.1 DAC1.1(VDD) GAINSW1.5(VCC) GAINSW2.5(VCC) GAINSW3.5(VCC) GAINSW4.5(VCC) IC1.1(AVDD1) IC1.12(AVDD2) IC1.13(AVDD2) IC1.48(AVDD1) IC2.1(AVDD1) IC2.12(AVDD2) IC2.13(AVDD2) IC2.48(AVDD1) OVSAMP1.5(VCC) OVSAMP2.5(VCC) REG1.2(OUT) REG1.TER(OUT) U1.8(V+) U2.8(V+)
Unconnected: DAC1.5(RDY/!BSY) FPGA.17(VREFB1) FPGA.30(VREFB2) FPGA.48(VREFB3) FPGA.61(VREFB4) FPGA.80(VREFB5) FPGA.97(VREFB6) FPGA.112(VREFB7) FPGA.123(VREFB8) IC1.8(I.C.) IC1.21(I.C.) IC1.22(I.C.) IC1.32(I.C.) IC1.33(I.C.) IC2.8(I.C.) IC2.21(I.C.) IC2.22(I.C.) IC2.32(I.C.) IC2.33(I.C.) IOEXPAND_0X20_BOT.7(GPB6) IOEXPAND_0X20_BOT.8(GPB7) IOEXPAND_0X20_BOT.19(INTB) IOEXPAND_0X20_BOT.20(INTA) IOEXPAND_0X20_BOT.27(GPA6) IOEXPAND_0X20_BOT.28(GPA7) IOEXPAND_0X24_TOP.19(INTB) IOEXPAND_0X24_TOP.20(INTA) JP1.4 JP1.8 OSC.1(TRI) SW_RESET.P$1 SW_RESET.P$3 SW_SUPER1.1 SW_SUPER2.1 SW_SUPER3.1 SW_SUPER4.1 U340G.9(CTS) U340G.10(DSR) U340G.11(RI) U340G.12(DCD) U340G.13(DTR) U340G.14(RTS) U340G.15(RS232) USB1.4(ID)

## Notes on the sheet
- LOW Speed | LOW Speed | LOW Speed | LOW Speed | LOW Speed | LOW Speed | LOW Speed | LOW Speed | LOW Speed | LOW Speed | LOW Speed
- LOW Speed
- LOW Speed
- LOW Speed
- LOW Speed

## Power pins joined to a net without a drawn wire
SLD: USB1.S1(SLD) USB1.S2(SLD) USB1.S3(SLD) USB1.S4(SLD)

## Library data of the parts
ACR1-ACR4 RLED1-RLED8 RLEDPOW = resistor:R-EU_: RESISTOR, European symbol; MPN: MF-RES-0805-560; OC_NEWARK: unknown
C0DD1_A C0DD2_A C0DD2_B C5VOPAMP1 C5VOPAMP2 C-AIN1-C-AIN4 CADD1_A CADD1_B CADD2_A CADD2_B CG15 CODD1_B COFFSET COFFSETB6 COFFSETB8 COFFSETB10 COFFSETB12 CP2 CP8 CREF1 CREF2 CV11 = rcl:C-EU: CAPACITOR, European symbol; MPN: MF-CAP-0805-0.1uF
C_5V_10NF C_5V_10NF1 C_AC1-C_AC4 C_OSC = rcl@1:C-US: CAPACITOR, American symbol; MFN: MF-CAP-0603-0.01uF
C_OSC1 C_OSC2 = rcl@1:C-US: CAPACITOR, American symbol; MFN: MF-CAP-0603-22pF
CG13 CP1 CP7 CP9-CP11 CV12 = rcl:C-EU: CAPACITOR, European symbol; MPN: MF-CAP-0805-1uF
CG14 COFFSETA1-COFFSETA3 COFFSETA6 CP3-CP6 = rcl@1:C-US: CAPACITOR, American symbol; MPN: MF-CAP-1206-10uF
CGAIN1_1-CGAIN1_4 = rcl@1:C-US: CAPACITOR, American symbol; MPN: 06033A330JAT2A
CH1-CH4 = SparkFun-Passives:CAP_ADJ: Variable, non-polarized capacitor; MPN: TZY2Z100AC01
CIN1NF_1-CIN1NF_4 = rcl@1:C-US: CAPACITOR, American symbol; MPN: 06035A102JAT2A
CIN5_1-CIN5_4 = rcl@1:C-US: CAPACITOR, American symbol; MPN: MF-CAP-0603-10pF
CIN56_1-CIN56_4 = rcl@1:C-US: CAPACITOR, American symbol; MPN: 06035A560FAT2A
CL1-CL4 = SparkFun-Passives:CAP_ADJ: Variable, non-polarized capacitor; MPN: TZY2K450AC01
DAC1 = Luca Eagle-Library:MCP4728; MFN: MCP4728-E/UN
FPGA = 10M08SAE144:10M08SAE144; MPN: 10M08SAE144C8G; OC_NEWARK: unknown
GAINSW1-GAINSW4 OVSAMP1 OVSAMP2 = 74xx-little-us:74*1G3157: Single-Pole, Double-Throw Analog Switch Source: http://focus.ti.com/lit/ds/symlink/sn74lvc1g3157.pdf; MPN: SN74LVC1G3157DBV
GOLD_ORB_SM1 = oshw:OSHWLOGO: The OSHW logo for PCB layout
IC1 IC2 = HaasMaxADC:MAX19506: The MAX19506 dual-channel, analog-to-digital converter (ADC) provides 8-bit resolution and a maximum sample rate of 100Msps.; MPN: MAX19506ETM+
IOEXPAND_0X20_BOT IOEXPAND_0X24_TOP = microchip:MCP23017: http://ww1.microchip.com/downloads/en/DeviceDoc/21952a.pdf Source: http://ww1.microchip.com/downloads/en/DeviceDoc/21952a.pdf; MF: MICROCHIP; MPN: MCP23017-E/SS; OC_FARNELL: 1467674; OC_NEWARK: 31K2960
J1-J4 = connector:MOLEX_BNC_73100-0105: CONN BNC JACK R/A 50 OHM PCB; DIGIKEY: WM5524-ND; MPN: 73100-0105
JP1 = Seeed-OPL-Connector:DIP-BLACK-MALE-HEADER(2X5P-2.54): 320020122
K1-K4 = relay:AQY*: PhotoMOS Relay NAiS Source: http://www.panasonic-electric-works.com/catalogues/downloads/photomos/ds_x615_en_aqz10_20.pdf; MPN: AQY210S; OC_FARNELL: unknown; OC_NEWARK: unknown
L1 L2 = SparkFun-Passives:INDUCTOR: Inductors Basic Inductor/Choke - 0603 and 1206. Footprints are not proven and vary greatly between part numbers. INDUCTOR POWER 3.3UH 4.0A SMD 0.197" L x 0.197" W x 0.177" H (5.00mm x 5.00mm x 4.50mm); MPN: MF-IND-1210-10uH
LED1-LED8 LEDPOW = led:LED: LED OSRAM: - CHIPLED LG R971, LG N971, LY N971, LG Q971, LY Q971, LO R971, LY R971 LH N974, LH R974 LS Q976, LO Q976, LY Q976 LO Q996 - Hyper CHIPLED LW Q18S LB Q993, LB Q99A, LB R99A - SideLED LS A670, LO A670, LY A670, LG A670, LP A670 LB A673, LV A673, LT A673, LW A673 LH A674 LY A675 LS A676, LA A676, LO A676, LY A676, LW A676 LS A679, LY A679, LG A679 - Hyper Micro SIDELED® LS Y876, LA Y876, LO Y876, LY Y876 LT Y87S - SmartLED LW L88C, LW L88S LB L89C, LB L89S, LG L890 LS L89K, LO L89K, LY L89K LS L896, LA L896, LO L896, LY L896 - TOPLED LS T670, LO T670, LY T670, LG T670, LP T670 LSG T670, LSP T670, LSY T670, LOP T670, LYG T670 LG T671, LOG T671, LSG T671 LB T673, LV T673, LT T673, LW T673 LH T674 LS T676, LA T676, LO T676, LY T676, LB T676, LH T676, LSB T676, LW T676 LB T67C, LV T67C, LT T67C, LS T67K, LO T67K, LY T67K, LW E67C LS E67B, LA E67B, LO E67B, LY E67B, LB E67C, LV E67C, LT E67C LW T67C LS T679, LY T679, LG T679 LS T770, LO T770, LY T770, LG T770, LP T770 LB T773, LV T773, LT T773, LW T773 LH T774 LS E675, LA E675, LY E675, LS T675 LS T776, LA T776, LO T776, LY T776, LB T776 LHGB T686 LT T68C, LB T68C - Hyper Mini TOPLED® LB M676 - Mini TOPLED Santana® LG M470 LS M47K, LO M47K, LY M47K Source: http://www.osram.convergy.de LUXEON: - LUMILED® LXK2-PW12-R00, LXK2-PW12-S00, LXK2-PW14-U00, LXK2-PW14-V00 LXK2-PM12-R00, LXK2-PM12-S00, LXK2-PM14-U00 LXK2-PE12-Q00, LXK2-PE12-R00, LXK2-PE12-S00, LXK2-PE14-T00, LXK2-PE14-U00 LXK2-PB12-K00, LXK2-PB12-L00, LXK2-PB12-M00, LXK2-PB14-N00, LXK2-PB14-P00, LXK2-PB14-Q00 LXK2-PR12-L00, LXK2-PR12-M00, LXK2-PR14-Q00, LXK2-PR14-R00 LXK2-PD12-Q00, LXK2-PD12-R00, LXK2-PD12-S00 LXK2-PH12-R00, LXK2-PH12-S00 LXK2-PL12-P00, LXK2-PL12-Q00, LXK2-PL12-R00 Source: www.luxeon.com KINGBRIGHT: KA-3528ASYC Source: www.kingbright.com; MPN: MF-LED-0805-RED; OC_NEWARK: unknown
OSC = crystal:ASE: 3.3Vdc CMOS SMD CRYSTAL CLOCK OSCILLATOR SOurce: www.abracon.com; MPN: ASE-50.000MHZ-ET; OC_FARNELL: unknown; OC_NEWARK: unknown
PIN_AIN_IO2_PWRGND PIN_ANALOG_IOEXP = pinhead+:PINHD-2X8: PIN HEADER; MPN: 15-91-2160
PIN_DISPLAY PIN_IO_1 = Seeed-Connector:DIP-YELLOW-FEMALE-HEADER-VERT(10P-2.54): 320030059
PIN_LEFT = Seeed-OPL-Connector:DIP-BLACK-SHORT-MALE-HEADER-R/A(8P-2.54-90D): 320020026
PIN_RIGHT = Seeed-OPL-Connector:DIP-BLACK-FEMALE-HEADER-R/A(8P-2.54-90D): 320030076
R10M_1-R10M_4 R50-1-R50-16 ROFFSET1-ROFFSET4 = rcl@1:R-US_: RESISTOR, American symbol
R_SCL R_SDA = resistor:R-EU_: RESISTOR, European symbol; MPN: MF-RES-0805-10K; OC_NEWARK: unknown
REG REG1 = Seeed-IC-2016:PMIC-CJT1117-3.3(SOT223): 310030097; MPN: LDL1117S33R; VALUE: CJT1117-3.3-SOT223
RGAIN1_1-RGAIN1_4 RGAIN3_1-RGAIN3_4 = resistor:R-EU_: RESISTOR, European symbol; MPN: MF-RES-0805-100k; OC_NEWARK: unknown
RGAIN2_1-RGAIN2_4 RGAIN4_1-RGAIN4_4 RIN1-RIN8 = resistor:R-EU_: RESISTOR, European symbol; MPN: MF-RES-0805-1M; OC_NEWARK: unknown
RIN1_10K RIN2_10K RIN3_10K RIN4_10K RJ2-RJ5 RS6-RS9 = resistor:R-EU_: RESISTOR, European symbol; MPN: MF-RES-0805-10K; OC_NEWARK: 05M4535
SW_5V SW_SUPER1-SW_SUPER4 SW_TERM1-SW_TERM4 = PP_Electromechanical:SPDT
SW_RESET = MF_Switches:TACT: Library: MF_Switches Description: Device for Tact Switches. Manufacture part number (MFG#) can be added via Attributes.; HOUSEPART: YES; MPN: MF-SW-TACT-4.2MM; POPULATE: 1; URL: https://factory.macrofab.com/part/MF-SW-TACT-4.2MM
U1 U2 = LMH6724:LMH6724MAX; MANUFACTURER_PART_NUMBER: MAX4416ESA
U340G = usb-serial:CH340G
USB1 = PP_Connectors:USB_5PIN; POPULATE: 1
Y1 = SparkFun-FreqCtrl:CRYSTAL: Various standard crystals. Proven footprints.

## Net classes
0 default: width 0.152 mm
1 gnd: width 0.305 mm
2 three: width 0.152 mm
3 five: width 0.381 mm